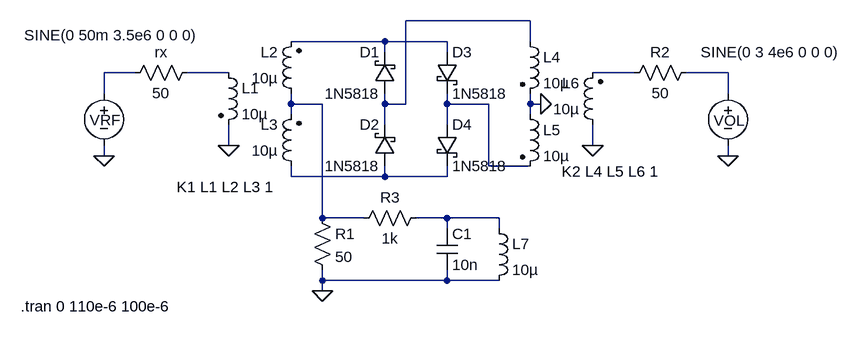
[diagram p0: schematic DobleBalancedMixer.asc]
DobleBalancedMixer.asc, the LTspice schematic file:
Version 4
SHEET 1 1076 680
WIRE 512 64 320 64
WIRE 288 96 144 96
WIRE 384 96 288 96
WIRE 512 96 512 64
WIRE 288 112 288 96
WIRE 384 112 384 96
WIRE -96 144 -144 144
WIRE 48 144 -16 144
WIRE 672 144 608 144
WIRE 816 144 752 144
WIRE -144 176 -144 144
WIRE 816 176 816 144
WIRE 144 192 144 176
WIRE 192 192 144 192
WIRE 288 192 288 176
WIRE 320 192 320 64
WIRE 320 192 288 192
WIRE 384 192 384 176
WIRE 448 192 384 192
WIRE 512 192 512 176
WIRE 528 192 512 192
WIRE 144 208 144 192
WIRE 512 208 512 192
WIRE 288 224 288 192
WIRE 384 224 384 192
WIRE 48 256 48 224
WIRE 608 256 608 224
WIRE -144 272 -144 256
WIRE 816 272 816 256
WIRE 448 288 448 192
WIRE 512 288 448 288
WIRE 144 304 144 288
WIRE 288 304 288 288
WIRE 288 304 144 304
WIRE 384 304 384 288
WIRE 384 304 288 304
WIRE 192 368 192 192
WIRE 256 368 192 368
WIRE 384 368 336 368
WIRE 464 368 384 368
WIRE 384 384 384 368
WIRE 464 384 464 368
WIRE 192 464 192 448
WIRE 384 464 384 448
WIRE 384 464 192 464
WIRE 464 464 384 464
WIRE 192 480 192 464
FLAG 608 256 0
FLAG 48 256 0
FLAG 528 192 0
FLAG 816 272 0
FLAG -144 272 0
FLAG 192 480 0
SYMBOL ind2 32 128 R0
SYMATTR InstName L1
SYMATTR Value 10µ
SYMATTR Type ind
SYMBOL ind2 160 192 R180
WINDOW 0 36 80 Left 2
WINDOW 3 36 40 Left 2
SYMATTR InstName L2
SYMATTR Value 10µ
SYMATTR Type ind
SYMBOL ind2 160 304 R180
WINDOW 0 36 80 Left 2
WINDOW 3 36 40 Left 2
SYMATTR InstName L3
SYMATTR Value 10µ
SYMATTR Type ind
SYMBOL ind2 496 80 R0
SYMATTR InstName L4
SYMATTR Value 10µ
SYMATTR Type ind
SYMBOL ind2 496 192 R0
SYMATTR InstName L5
SYMATTR Value 10µ
SYMATTR Type ind
SYMBOL ind2 624 240 R180
WINDOW 0 36 80 Left 2
WINDOW 3 36 40 Left 2
SYMATTR InstName L6
SYMATTR Value 10µ
SYMATTR Type ind
SYMBOL res 0 128 R90
WINDOW 0 0 56 VBottom 2
WINDOW 3 32 56 VTop 2
SYMATTR InstName rx
SYMATTR Value 50
SYMBOL res 768 128 R90
WINDOW 0 0 56 VBottom 2
WINDOW 3 32 56 VTop 2
SYMATTR InstName R2
SYMATTR Value 50
SYMBOL schottky 304 176 R180
WINDOW 0 24 64 Left 2
WINDOW 3 24 0 Left 2
SYMATTR InstName D1
SYMATTR Value 1N5818
SYMATTR Description Diode
SYMATTR Type diode
SYMBOL schottky 304 288 R180
WINDOW 0 24 64 Left 2
WINDOW 3 24 0 Left 2
SYMATTR InstName D2
SYMATTR Value 1N5818
SYMATTR Description Diode
SYMATTR Type diode
SYMBOL schottky 368 112 R0
SYMATTR InstName D3
SYMATTR Value 1N5818
SYMATTR Description Diode
SYMATTR Type diode
SYMBOL schottky 368 224 R0
SYMATTR InstName D4
SYMATTR Value 1N5818
SYMATTR Description Diode
SYMATTR Type diode
SYMBOL voltage 816 160 R0
WINDOW 0 -22 58 Left 2
WINDOW 3 -42 -48 Left 2
WINDOW 123 0 0 Left 0
WINDOW 39 0 0 Left 0
SYMATTR InstName VOL
SYMATTR Value SINE(0 3 4e6 0 0 0)
SYMBOL voltage -144 160 R0
WINDOW 0 -22 57 Left 2
WINDOW 3 -123 -74 Left 2
WINDOW 123 0 0 Left 0
WINDOW 39 0 0 Left 0
SYMATTR InstName VRF
SYMATTR Value SINE(0 50m 3.5e6 0 0 0)
SYMBOL res 176 352 R0
SYMATTR InstName R1
SYMATTR Value 50
SYMBOL res 352 352 R90
WINDOW 0 0 56 VBottom 2
WINDOW 3 32 56 VTop 2
SYMATTR InstName R3
SYMATTR Value 1k
SYMBOL cap 368 384 R0
SYMATTR InstName C1
SYMATTR Value 10n
SYMBOL ind 448 368 R0
SYMATTR InstName L7
SYMATTR Value 10µ
TEXT -32 320 Left 2 !K1 L1 L2 L3 1
TEXT 560 296 Left 2 !K2 L4 L5 L6 1
TEXT -272 504 Left 2 !.tran 0 110e-6 100e-6

The netlist it stands for:
* DobleBalancedMixer.asc
L1 N004 0 10µ
L2 N007 N002 10µ
L3 N009 N007 10µ
L4 N001 0 10µ
L5 0 N008 10µ
L6 0 N005 10µ
rx N004 N003 50
R2 N006 N005 50
D1 N001 N002 1N5818
D2 N009 N001 1N5818
D3 N002 N008 1N5818
D4 N008 N009 1N5818
VOL N006 0 SINE(0 3 4e6 0 0 0)
VRF N003 0 SINE(0 50m 3.5e6 0 0 0)
R1 N007 0 50
R3 N010 N007 1k
C1 N010 0 10n
L7 N010 0 10µ
.model D D
.lib standard.dio
K1 L1 L2 L3 1
K2 L4 L5 L6 1
.tran 0 110e-6 100e-6
.backanno
.end